# Altium project ESP32.PrjPcb (part 1 of 3)
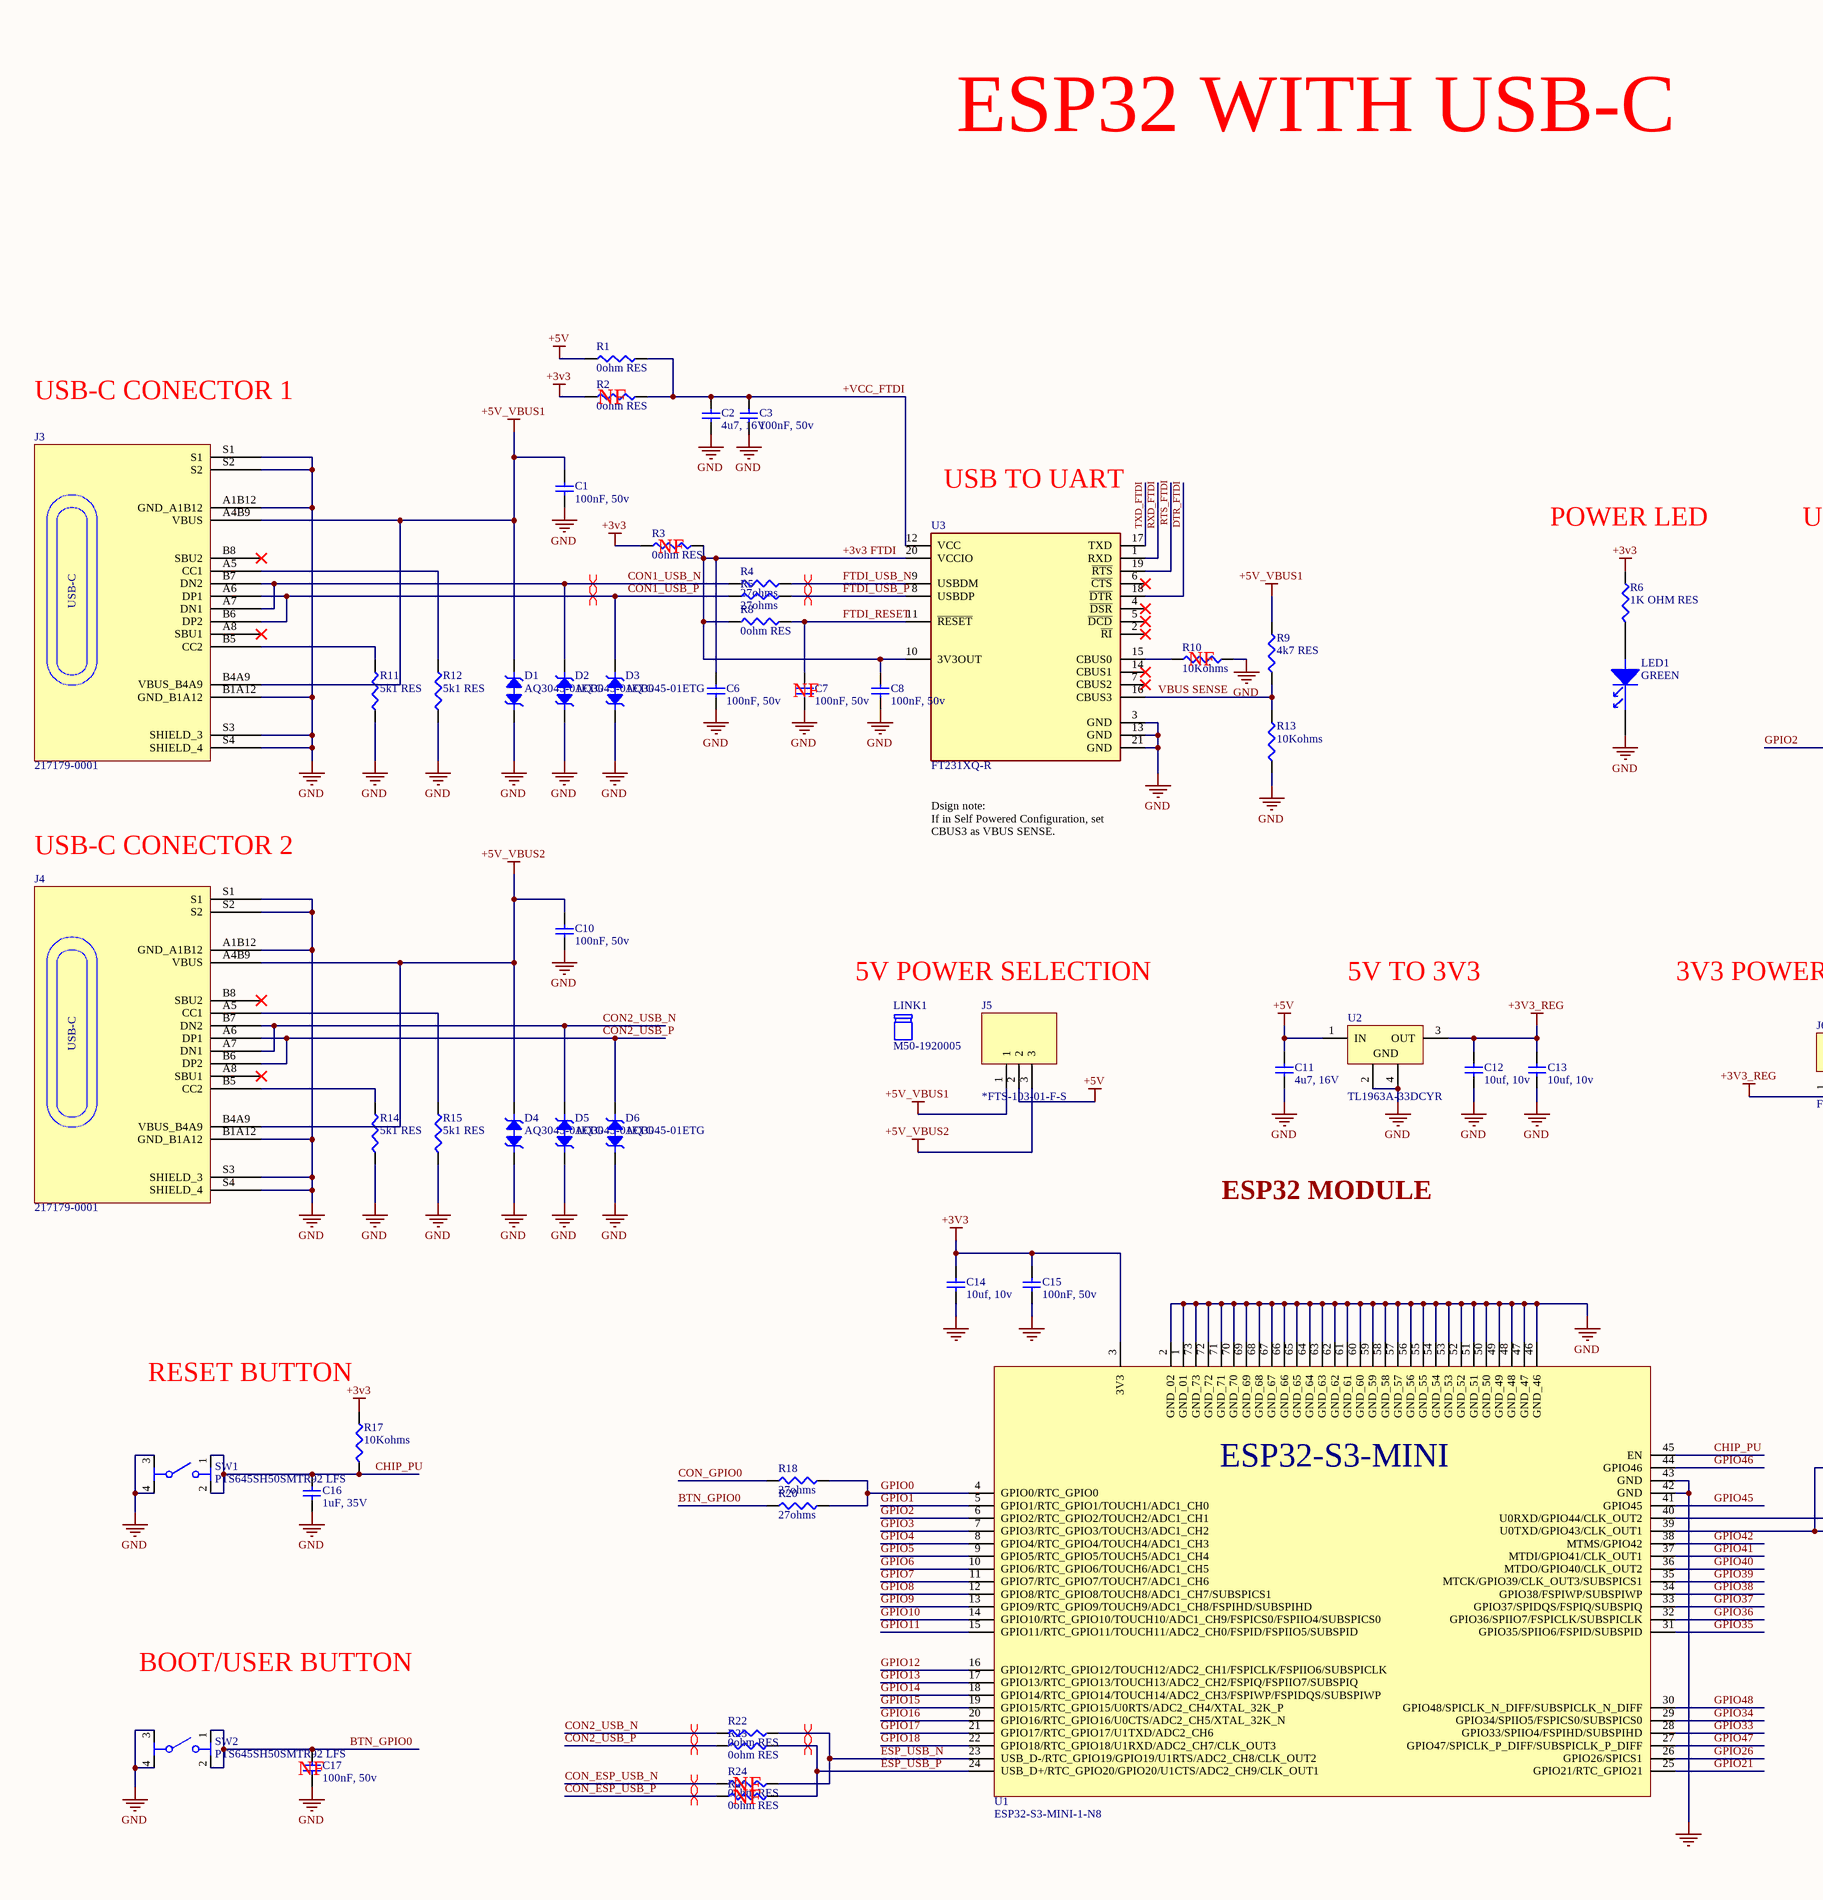
[diagram p0: Sheet1.SchDoc, left]
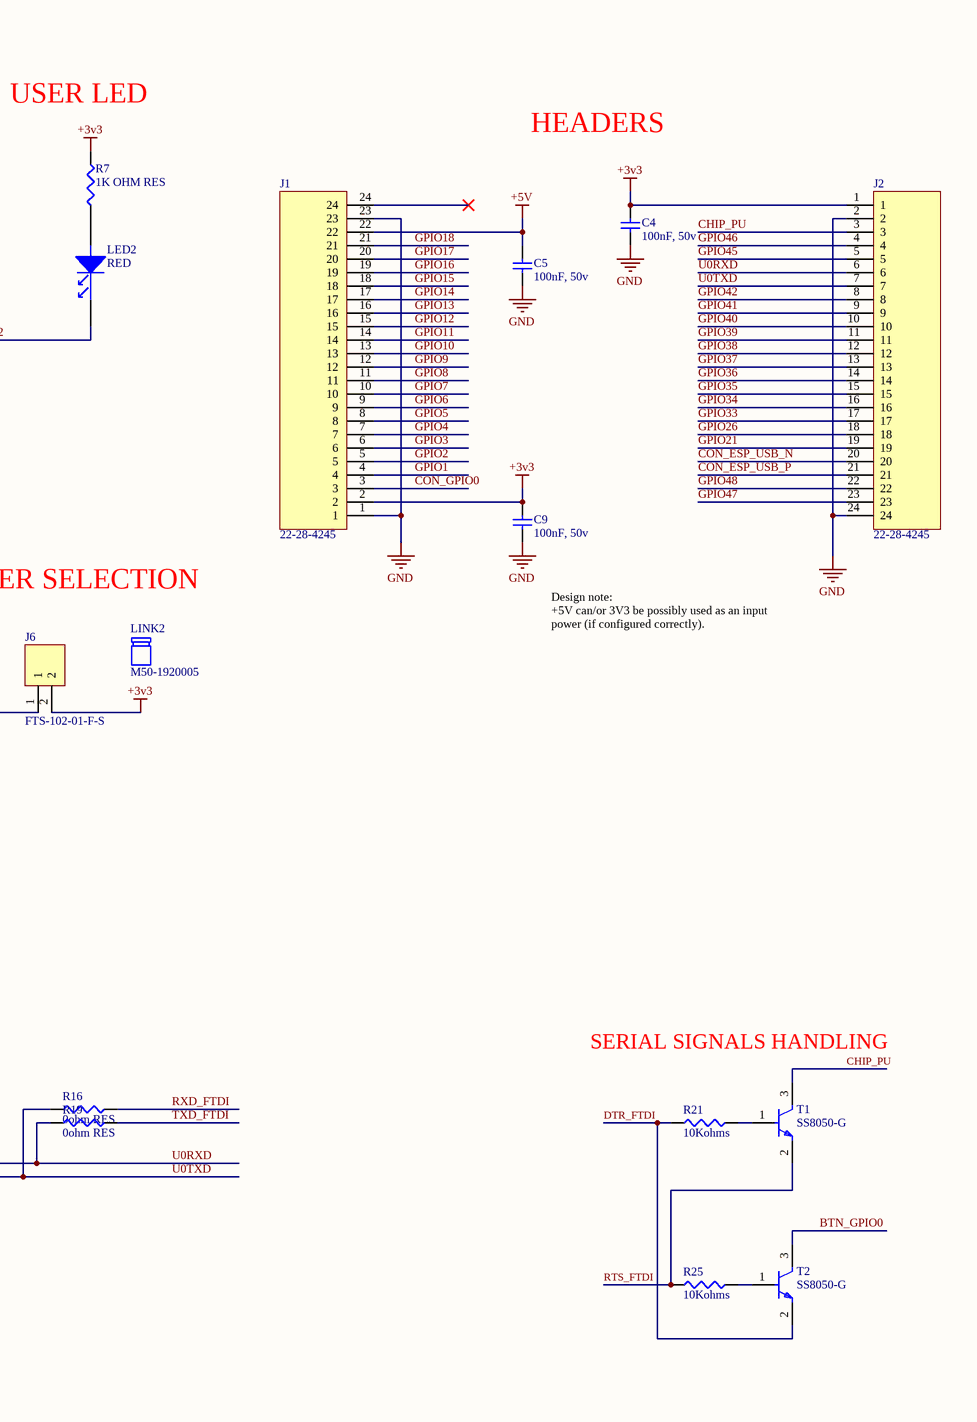
[diagram p1: Sheet1.SchDoc, right]
1 sheet, 66 parts. Net scope: global (net labels, ports and power ports of the same name join across sheets).
Board file: PCB1.PcbDoc

## Sheet Sheet1.SchDoc
size A2; SheetNumber: 1; SheetTotal: 1

### Parts
C1  100nF, 50v  [CAPC1005X55N]
C2  4u7, 16V  [CAPC1005X55N]
C3  100nF, 50v  [CAPC1005X55N]
C4  100nF, 50v  [CAPC1005X55N]
C5  100nF, 50v  [CAPC1005X55N]
C6  100nF, 50v  [CAPC1005X55N]
C7  100nF, 50v  [CAPC1005X55N]
C8  100nF, 50v  [CAPC1005X55N]
C9  100nF, 50v  [CAPC1005X55N]
C10  100nF, 50v  [CAPC1005X55N]
C11  4u7, 16V  [CAPC1005X55N]
C12  10uf, 10v  [CAPC1005X55N]
C13  10uf, 10v  [CAPC1005X55N]
C14  10uf, 10v  [CAPC1005X55N]
C15  100nF, 50v  [CAPC1005X55N]
C16  1uF, 35V  [CAPC1005X55N]
C17  100nF, 50v  [CAPC1005X55N]
D1  AQ3045-01ETG  [SOD882]
D2  AQ3045-01ETG  [SOD882]
D3  AQ3045-01ETG  [SOD882]
D4  AQ3045-01ETG  [SOD882]
D5  AQ3045-01ETG  [SOD882]
D6  AQ3045-01ETG  [SOD882]
J1  22-28-4245  [HDR_1X24_2.54MM]
J2  22-28-4245  [HDR_1X24_2.54MM]
J3  217179-0001  [FP-2171790001-MFG]
J4  217179-0001  [FP-2171790001-MFG]
J5  *FTS-103-01-F-S  [HDR_1X3_1.27MM]
J6  FTS-102-01-F-S  [HDR_1X2_1.27MM]
LED1  GREEN  [LED_0402_GREEN]
LED2  RED  [LED_0402_RED]
LINK1  M50-1920005  (mechanical)
LINK2  M50-1920005  (mechanical)
R1  0ohm RES  [RESC1005X37N]
R2  0ohm RES  [RESC1005X37N]
R3  0ohm RES  [RESC1005X37N]
R4  27ohms  [RESC1005X37N]
R5  27ohms  [RESC1005X37N]
R6  1K OHM RES  [RESC1005X37N]
R7  1K OHM RES  [RESC1005X37N]
R8  0ohm RES  [RESC1005X37N]
R9  4k7 RES  [RESC1005X37N]
R10  10Kohms  [RESC1005X37N]
R11  5k1 RES  [RESC1005X37N]
R12  5k1 RES  [RESC1005X37N]
R13  10Kohms  [RESC1005X37N]
R14  5k1 RES  [RESC1005X37N]
R15  5k1 RES  [RESC1005X37N]
R16  0ohm RES  [RESC1005X37N]
R17  10Kohms  [RESC1005X37N]
R18  27ohms  [RESC1005X37N]
R19  0ohm RES  [RESC1005X37N]
R20  27ohms  [RESC1005X37N]
R21  10Kohms  [RESC1005X37N]
R22  0ohm RES  [RESC1005X37N]
R23  0ohm RES  [RESC1005X37N]
R24  0ohm RES  [RESC1005X37N]
R25  10Kohms  [RESC1005X37N]
R26  0ohm RES  [RESC1005X37N]
SW1  PTS645SH50SMTR92 LFS  [FP-PTS645SH50SMTR92LFS-MFG]
SW2  PTS645SH50SMTR92 LFS  [FP-PTS645SH50SMTR92LFS-MFG]
T1  SS8050-G  [FP-SS8050-G-IPC_B]
T2  SS8050-G  [FP-SS8050-G-IPC_B]
U1  ESP32-S3-MINI-1-N8  [XCVR_ESP32-S3-MINI-1-N8]
U2  TL1963A-33DCYR  [DCY0004A_N]
U3  FT231XQ-R  [FP-QFN-20-IPC_B]

### Nets
+3v3: C4.2 C9.2 C14.2 C15.2 J1.2 J2.1 J6.2 R2.1 R3.1 R6.2 R7.2 R17.2 U1.3(3V3)
+3V3_REG: C12.1 C13.1 J6.1 U2.3(OUT)
+5V: C5.2 C11.2 J1.22 J5.2 R1.1 U2.1(IN)
+5V_VBUS1: C1.2 D1.2 J3.A4B9(VBUS) J3.B4A9(VBUS_B4A9) J5.1 R9.2
+5V_VBUS2: C10.2 D4.2 J4.A4B9(VBUS) J4.B4A9(VBUS_B4A9) J5.3
GND: C1.1 C2.1 C3.1 C4.1 C5.1 C6.1 C7.1 C8.1 C9.1 C10.1 C11.1 C12.2 C13.2 C14.1 C15.1 C16.1 C17.1 D1.1 D2.1 D3.1 D4.1 D5.1 D6.1 J1.1 J1.23 J2.2 J2.24 J3.A1B12(GND_A1B12) J3.B1A12(GND_B1A12) J3.S1 J3.S2 J3.S3(SHIELD_3) J3.S4(SHIELD_4) J4.A1B12(GND_A1B12) J4.B1A12(GND_B1A12) J4.S1 J4.S2 J4.S3(SHIELD_3) J4.S4(SHIELD_4) LED1.1 R10.2 R11.2 R12.2 R13.1 R14.2 R15.2 SW1.3 SW1.4 SW2.3 SW2.4 U1.1(GND_01) U1.2(GND_02) U1.42(GND) U1.43(GND) U1.46(GND_46) U1.47(GND_47) U1.48(GND_48) U1.49(GND_49) U1.50(GND_50) U1.51(GND_51) U1.52(GND_52) U1.53(GND_53) U1.54(GND_54) U1.55(GND_55) U1.56(GND_56) U1.57(GND_57) U1.58(GND_58) U1.59(GND_59) U1.60(GND_60) U1.61(GND_61) U1.62(GND_62) U1.63(GND_63) U1.64(GND_64) U1.65(GND_65) U1.66(GND_66) U1.67(GND_67) U1.68(GND_68) U1.69(GND_69) U1.70(GND_70) U1.71(GND_71) U1.72(GND_72) U1.73(GND_73) U2.2(GND) U2.4(GND) U3.3(GND) U3.13(GND) U3.21(GND)
+3v3 FTDI: C6.2 C8.2 R3.2 R8.1 U3.10(3V3OUT) U3.20(VCCIO)
+VCC_FTDI: C2.2 C3.2 R1.2 R2.2 U3.12(VCC)
BTN_GPIO0: C17.2 R20.1 SW2.1 SW2.2 T2.3(C)
CHIP_PU: C16.2 J2.3 R17.1 SW1.1 SW1.2 T1.3(C) U1.45(EN)
CON1_USB_N: D2.2 J3.A7(DN1) J3.B7(DN2) R4.1
CON1_USB_P: D3.2 J3.A6(DP1) J3.B6(DP2) R5.1
CON2_USB_N: D5.2 J4.A7(DN1) J4.B7(DN2) R22.1
CON2_USB_P: D6.2 J4.A6(DP1) J4.B6(DP2) R23.1
CON_ESP_USB_N: J2.20 R24.1
CON_ESP_USB_P: J2.21 R26.1
CON_GPIO0: J1.3 R18.1
DTR_FTDI: R21.2 T2.2(E) U3.18(~{DTR})
ESP_USB_N: R22.2 R24.2 U1.23(USB_D-/RTC_GPIO19/GPIO19/U1RTS/ADC2_CH8/CLK_OUT2)
ESP_USB_P: R23.2 R26.2 U1.24(USB_D+/RTC_GPIO20/GPIO20/U1CTS/ADC2_CH9/CLK_OUT1)
FTDI_RESET: C7.2 R8.2 U3.11(~{RESET})
FTDI_USB_N: R4.2 U3.9(USBDM)
FTDI_USB_P: R5.2 U3.8(USBDP)
GPIO0: R18.2 R20.2 U1.4(GPIO0/RTC_GPIO0)
GPIO1: J1.4 U1.5(GPIO1/RTC_GPIO1/TOUCH1/ADC1_CH0)
GPIO2: J1.5 LED2.1 U1.6(GPIO2/RTC_GPIO2/TOUCH2/ADC1_CH1)
GPIO3: J1.6 U1.7(GPIO3/RTC_GPIO3/TOUCH3/ADC1_CH2)
GPIO4: J1.7 U1.8(GPIO4/RTC_GPIO4/TOUCH4/ADC1_CH3)
GPIO5: J1.8 U1.9(GPIO5/RTC_GPIO5/TOUCH5/ADC1_CH4)
GPIO6: J1.9 U1.10(GPIO6/RTC_GPIO6/TOUCH6/ADC1_CH5)
GPIO7: J1.10 U1.11(GPIO7/RTC_GPIO7/TOUCH7/ADC1_CH6)
GPIO8: J1.11 U1.12(GPIO8/RTC_GPIO8/TOUCH8/ADC1_CH7/SUBSPICS1)
GPIO9: J1.12 U1.13(GPIO9/RTC_GPIO9/TOUCH9/ADC1_CH8/FSPIHD/SUBSPIHD)
GPIO10: J1.13 U1.14(GPIO10/RTC_GPIO10/TOUCH10/ADC1_CH9/FSPICS0/FSPIIO4/SUBSPICS0)
GPIO11: J1.14 U1.15(GPIO11/RTC_GPIO11/TOUCH11/ADC2_CH0/FSPID/FSPIIO5/SUBSPID)
GPIO12: J1.15 U1.16(GPIO12/RTC_GPIO12/TOUCH12/ADC2_CH1/FSPICLK/FSPIIO6/SUBSPICLK)
GPIO13: J1.16 U1.17(GPIO13/RTC_GPIO13/TOUCH13/ADC2_CH2/FSPIQ/FSPIIO7/SUBSPIQ)
GPIO14: J1.17 U1.18(GPIO14/RTC_GPIO14/TOUCH14/ADC2_CH3/FSPIWP/FSPIDQS/SUBSPIWP)
GPIO15: J1.18 U1.19(GPIO15/RTC_GPIO15/U0RTS/ADC2_CH4/XTAL_32K_P)
GPIO16: J1.19 U1.20(GPIO16/RTC_GPIO16/U0CTS/ADC2_CH5/XTAL_32K_N)
GPIO17: J1.20 U1.21(GPIO17/RTC_GPIO17/U1TXD/ADC2_CH6)
GPIO18: J1.21 U1.22(GPIO18/RTC_GPIO18/U1RXD/ADC2_CH7/CLK_OUT3)
GPIO21: J2.19 U1.25(GPIO21/RTC_GPIO21)
GPIO26: J2.18 U1.26(GPIO26/SPICS1)
GPIO33: J2.17 U1.28(GPIO33/SPIIO4/FSPIHD/SUBSPIHD)
GPIO34: J2.16 U1.29(GPIO34/SPIIO5/FSPICS0/SUBSPICS0)
GPIO35: J2.15 U1.31(GPIO35/SPIIO6/FSPID/SUBSPID)
GPIO36: J2.14 U1.32(GPIO36/SPIIO7/FSPICLK/SUBSPICLK)
GPIO37: J2.13 U1.33(GPIO37/SPIDQS/FSPIQ/SUBSPIQ)
GPIO38: J2.12 U1.34(GPIO38/FSPIWP/SUBSPIWP)
GPIO39: J2.11 U1.35(MTCK/GPIO39/CLK_OUT3/SUBSPICS1)
GPIO40: J2.10 U1.36(MTDO/GPIO40/CLK_OUT2)
GPIO41: J2.9 U1.37(MTDI/GPIO41/CLK_OUT1)
GPIO42: J2.8 U1.38(MTMS/GPIO42)
GPIO45: J2.5 U1.41(GPIO45)
GPIO46: J2.4 U1.44(GPIO46)
GPIO47: J2.23 U1.27(GPIO47/SPICLK_P_DIFF/SUBSPICLK_P_DIFF)
GPIO48: J2.22 U1.30(GPIO48/SPICLK_N_DIFF/SUBSPICLK_N_DIFF)
RTS_FTDI: R25.2 T1.2(E) U3.19(~{RTS})
RXD_FTDI: R16.2 U3.1(RXD)
TXD_FTDI: R19.2 U3.17(TXD)
U0RXD: J2.6 R19.1 U1.40(U0RXD/GPIO44/CLK_OUT2)
U0TXD: J2.7 R16.1 U1.39(U0TXD/GPIO43/CLK_OUT1)
VBUS SENSE: R9.1 R13.2 U3.16(CBUS3)
NetJ3_A5: J3.A5(CC1) R12.1
NetJ3_B5: J3.B5(CC2) R11.1
NetJ4_A5: J4.A5(CC1) R15.1
NetJ4_B5: J4.B5(CC2) R14.1
NetLED1_2: LED1.2 R6.1
NetLED2_2: LED2.2 R7.1
NetR10_1: R10.1 U3.15(CBUS0)
NetR21_1: R21.1 T1.1(B)
NetR25_1: R25.1 T2.1(B)

Not connected (* = marked no-connect by the designer): J1 24*; J3 A8(SBU1)* B8(SBU2)*; J4 A8(SBU1)* B8(SBU2)*; U3 2(~{RI})* 4(~{DSR})* 5(~{DCD})* 6(~{CTS})* 7(CBUS2)* 14(CBUS1)*

### Layout directives
differential pair; differential pair class DIFF90: CON1_USB_N, CON1_USB_P, CON2_USB_N, CON2_USB_P, CON_ESP_USB_N, CON_ESP_USB_P, ESP_USB_N, ESP_USB_P, FTDI_USB_N, FTDI_USB_P

### Notes on the sheet
- ESP32 WITH USB-C
- USB-C CONECTOR 1
- (near R2) NF
- USB TO UART
- (near R3) NF
- POWER LED
- USER LED
- HEADERS
- (near C7) NF
- (near R10) NF
- (near J4) USB-C CONECTOR 2
- Dsign note:
  If in Self Powered Configuration, set CBUS3 as VBUS SENSE.
- (near LINK1) 5V POWER SELECTION
- 5V TO 3V3
- (near LINK2) 3V3 POWER SELECTION
- Design note:
  +5V can/or 3V3 be possibly used as an input
  power (if configured correctly).
- ESP32 MODULE
- RESET BUTTON
- SERIAL SIGNALS HANDLING
- BOOT/USER BUTTON
- (near C17) NF
- NF
- (in symbol 217179-0001) USB-C
- (in symbol ESP32-S3-MINI-1-N8) ESP32-S3-MINI